# Altium schematic sheet 0_Overview.SchDoc
size A; SheetNumber: 1; SheetTotal: 4
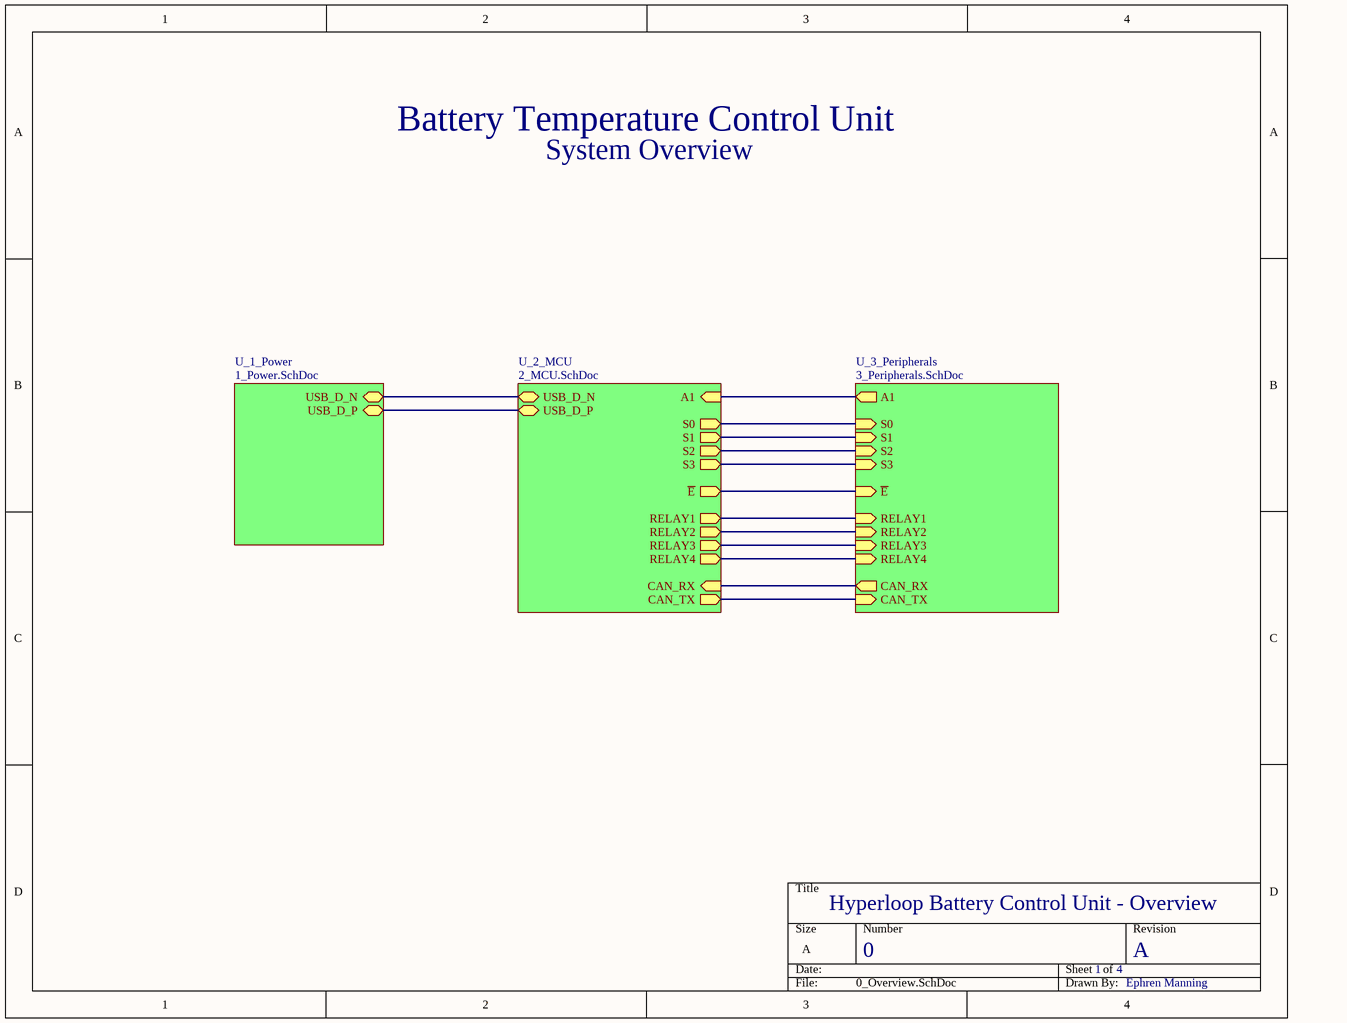
[diagram p0: 0_Overview.SchDoc]

## Sub-sheets
U_1_Power = 1_Power.SchDoc: USB_D_N (bidir), USB_D_P (bidir)
U_2_MCU = 2_MCU.SchDoc: USB_D_P (bidir), USB_D_N (bidir), A1 (in), S0 (out), S1 (out), S2 (out), S3 (out), RELAY1 (out), RELAY2 (out), RELAY3 (out), RELAY4 (out), ~{E} (out), CAN_RX (in), CAN_TX (out)
U_3_Peripherals = 3_Peripherals.SchDoc: CAN_TX (in), CAN_RX (out), S0 (in), S1 (in), S2 (in), S3 (in), ~{E} (in), A1 (out), RELAY1 (in), RELAY2 (in), RELAY3 (in), RELAY4 (in)

## Nets
(unnamed): sheet U_1_Power/USB_D_N, sheet U_2_MCU/USB_D_N
(unnamed): sheet U_1_Power/USB_D_P, sheet U_2_MCU/USB_D_P
(unnamed): sheet U_2_MCU/A1, sheet U_3_Peripherals/A1
(unnamed): sheet U_2_MCU/S0, sheet U_3_Peripherals/S0
(unnamed): sheet U_2_MCU/S1, sheet U_3_Peripherals/S1
(unnamed): sheet U_2_MCU/S2, sheet U_3_Peripherals/S2
(unnamed): sheet U_2_MCU/S3, sheet U_3_Peripherals/S3
(unnamed): sheet U_2_MCU/RELAY1, sheet U_3_Peripherals/RELAY1
(unnamed): sheet U_2_MCU/RELAY2, sheet U_3_Peripherals/RELAY2
(unnamed): sheet U_2_MCU/RELAY3, sheet U_3_Peripherals/RELAY3
(unnamed): sheet U_2_MCU/RELAY4, sheet U_3_Peripherals/RELAY4
(unnamed): sheet U_2_MCU/~{E}, sheet U_3_Peripherals/~{E}
(unnamed): sheet U_2_MCU/CAN_RX, sheet U_3_Peripherals/CAN_RX
(unnamed): sheet U_2_MCU/CAN_TX, sheet U_3_Peripherals/CAN_TX

## Notes on the sheet
- Battery Temperature Control Unit
- System Overview
- Hyperloop Battery Control Unit - Overview
- 0
- 1
- 4
- A
- Ephren Manning